# EAGLE design Modul_C_002x EAGLE 630 (EAGLE 6.3)
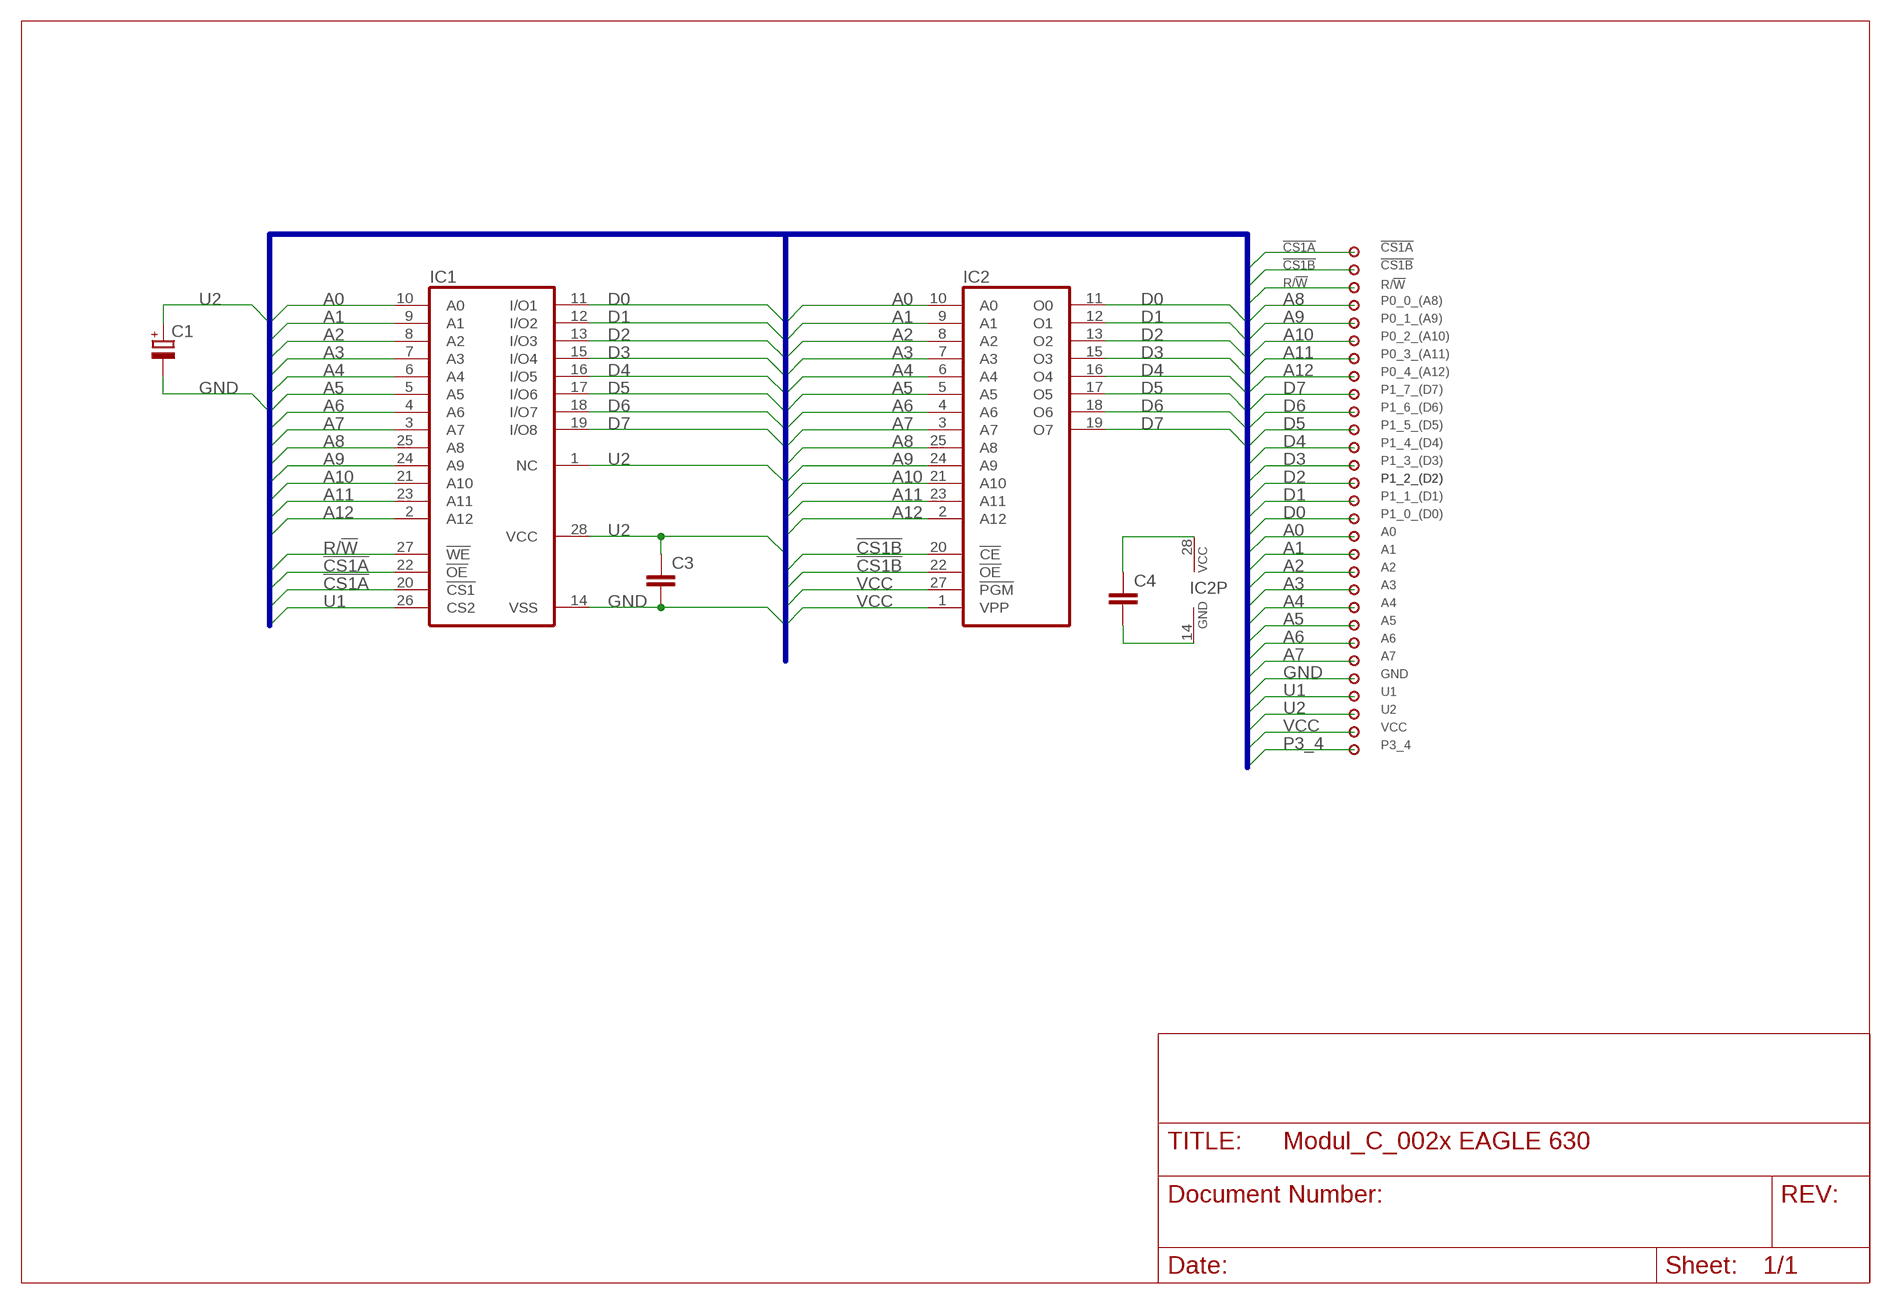
[diagram p0: schematic, sheet 1]

## Parts
C1  CPOL-EUE15-6AXIAL  [E15-6]
C3  C-EU025-024X044  [C025-024X044]
C4  C-EU025-024X044  [C025-024X044]
IC1  6264A  [DIL28-6]
IC2  2764  [DIL28]
U$1  BUS2929PUR  [BUS29_PUR]

## Nets
!CS1A: IC1.20(!CS1) IC1.22(!OE) U$1.1.29
!CS1B: IC2.20(!CE) IC2.22(!OE) U$1.1.28
A0: IC1.10(A0) IC2.10(A0) U$1.1.13
A1: IC1.9(A1) IC2.9(A1) U$1.1.12
A2: IC1.8(A2) IC2.8(A2) U$1.1.11
A3: IC1.7(A3) IC2.7(A3) U$1.1.10
A4: IC1.6(A4) IC2.6(A4) U$1.1.9
A5: IC1.5(A5) IC2.5(A5) U$1.1.8
A6: IC1.4(A6) IC2.4(A6) U$1.1.7
A7: IC1.3(A7) IC2.3(A7) U$1.1.6
A8: IC1.25(A8) IC2.25(A8) U$1.1.26
A9: IC1.24(A9) IC2.24(A9) U$1.1.25
A10: IC1.21(A10) IC2.21(A10) U$1.1.24
A11: IC1.23(A11) IC2.23(A11) U$1.1.23
A12: IC1.2(A12) IC2.2(A12) U$1.1.22
D0: IC1.11(I/O1) IC2.11(O0) U$1.1.14
D1: IC1.12(I/O2) IC2.12(O1) U$1.1.15
D2: IC1.13(I/O3) IC2.13(O2) U$1.1.16
D3: IC1.15(I/O4) IC2.15(O3) U$1.1.17
D4: IC1.16(I/O5) IC2.16(O4) U$1.1.18
D5: IC1.17(I/O6) IC2.17(O5) U$1.1.19
D6: IC1.18(I/O7) IC2.18(O6) U$1.1.20
D7: IC1.19(I/O8) IC2.19(O7) U$1.1.21
GND: C1.- C3.2 C4.2 IC1.14(VSS) IC2.14(GND) U$1.1.5
P3_4: U$1.1.1
R/!W: IC1.27(!WE) U$1.1.27
U1: IC1.26(CS2) U$1.1.4
U2: C1.+ C3.1 IC1.1(NC) IC1.28(VCC) U$1.1.3
VCC: C4.1 IC2.1(VPP) IC2.27(!PGM) IC2.28(VCC) U$1.1.2

## Buses
BUS1:A[0..12],D[0..7],GND,U1,U2,VCC,P3_4,R/!W,!CS1B,!CS1A

## Notes on the sheet
- !CS1A
- !CS1B
- GND
- U1
- U2
- VCC
- P3_4

## Library data of the parts
C1 = rcl:CPOL-EU: POLARIZED CAPACITOR, European symbol
C3 C4 = rcl:C-EU: CAPACITOR, European symbol
IC1 = memory-hitachi:6264A: MEMORY; OC_FARNELL: 283605; OC_NEWARK: unknown
IC2 = memory:2764: MEMORY
U$1 = NRF24L01_Radio:BUS29

## Board
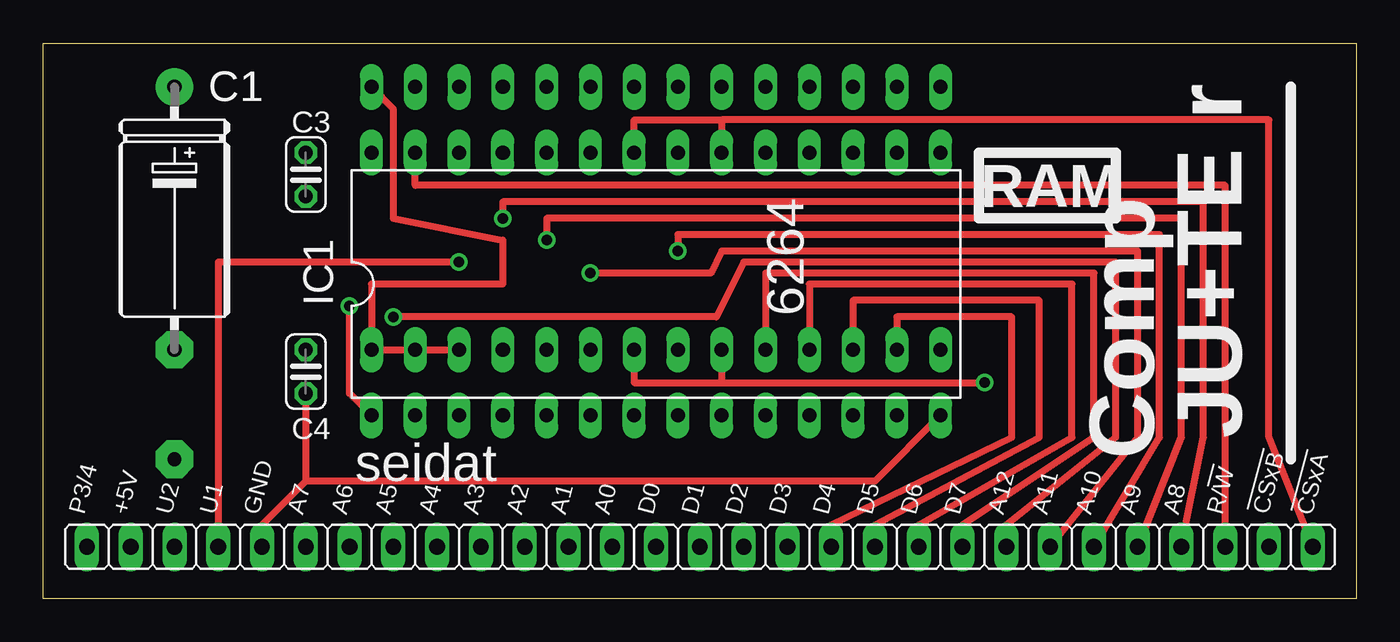
[diagram p1: board, top side]
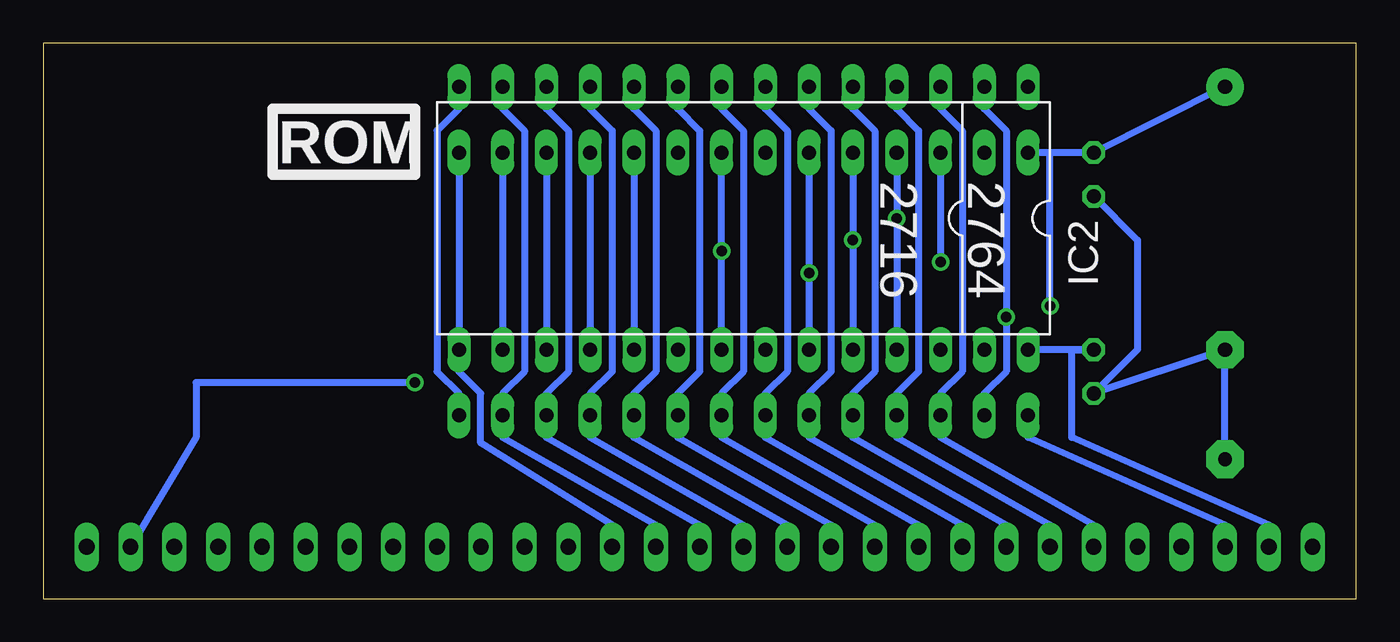
[diagram p2: board, bottom side, seen from below]

Size 76.19 x 32.22 mm. Coordinates in mm from the lower left corner, seen from the top.
Outline: 0,32.22 76.19,32.22 76.19,0 0,0 0,32.22
Copper layers (1*16): Top 0.035mm / dielectric 1.5mm / Bottom 0.035mm
Design rules "default": minimum track width 10mil, minimum drill 24mil, track to track 8mil, track to pad 8mil, pad to pad 8mil, via to via 8mil, smd to smd 8mil, copper to edge 40mil, drill to drill 8mil, minimum pad ring 10mil, minimum via ring 8mil, stop-mask expansion 4mil, vias tented up to drill 0mil, thermal gap 10mil

### Footprints (pad centres in the part's own frame; a part is rotated, then mirrored left to right if it is on the bottom)
E15-6 = drill 0.813 pad 2.159: + -7.62,0 | drill 0.813 pad 2.159 octagon: - 7.62,0
C025-024X044 = drill 0.813 octagon: 1 -1.27,0; 2 1.27,0
DIL28-6 = drill 0.813 long: 1 -16.51,-7.62; 2 -13.97,-7.62; 3 -11.43,-7.62; 4 -8.89,-7.62; 5 -6.35,-7.62; 6 -3.81,-7.62; 7 -1.27,-7.62; 8 1.27,-7.62; 9 3.81,-7.62; 10 6.35,-7.62; 11 8.89,-7.62; 12 11.43,-7.62; 13 13.97,-7.62; 14 16.51,-7.62; 15 16.51,7.62; 16 13.97,7.62; 17 11.43,7.62; 18 8.89,7.62; 19 6.35,7.62; 20 3.81,7.62; 21 1.27,7.62; 22 -1.27,7.62; 23 -3.81,7.62; 24 -6.35,7.62; 25 -8.89,7.62; 26 -11.43,7.62; 27 -13.97,7.62; 28 -16.51,7.62
DIL28 = drill 0.813 long: 1 -16.51,-7.62; 2 -13.97,-7.62; 3 -11.43,-7.62; 4 -8.89,-7.62; 5 -6.35,-7.62; 6 -3.81,-7.62; 7 -1.27,-7.62; 8 1.27,-7.62; 9 3.81,-7.62; 10 6.35,-7.62; 11 8.89,-7.62; 12 11.43,-7.62; 13 13.97,-7.62; 14 16.51,-7.62; 15 16.51,7.62; 16 13.97,7.62; 17 11.43,7.62; 18 8.89,7.62; 19 6.35,7.62; 20 3.81,7.62; 21 1.27,7.62; 22 -1.27,7.62; 23 -3.81,7.62; 24 -6.35,7.62; 25 -8.89,7.62; 26 -11.43,7.62; 27 -13.97,7.62; 28 -16.51,7.62
BUS29_PUR = drill 0.914 long: 1.1 0,0; 1.2 0,2.54; 1.3 0,5.08; 1.4 0,7.62; 1.5 0,10.16; 1.6 0,12.7; 1.7 0,15.24; 1.8 0,17.78; 1.9 0,20.32; 1.10 0,22.86; 1.11 0,25.4; 1.12 0,27.94; 1.13 0,30.48; 1.14 0,33.02; 1.15 0,35.56; 1.16 0,38.1; 1.17 0,40.64; 1.18 0,43.18; 1.19 0,45.72; 1.20 0,48.26; 1.21 0,50.8; 1.22 0,53.34; 1.23 0,55.88; 1.24 0,58.42; 1.25 0,60.96; 1.26 0,63.5; 1.27 0,66.04; 1.28 0,68.58; 1.29 0,71.12

### Placement (x,y rotation side)
C1  7.62,22.06 270 top
C3  15.24,24.6 270 top
C4  15.24,13.17 270 top
IC1  35.56,18.25 0 top
IC2  35.56,22.06 180 bottom
U$1  2.54,3.01 270 top

### Tracks (layer width: path | path; a pad name or v marks a point on that pad's centre or on a via)
!CS1A
  Top 0.406: U$1.1.29 71.12,9.36 71.12,27.77 39.37,27.77 | 39.37,27.77 IC1.20 | IC1.22 34.29,27.77 39.37,27.77
!CS1B  (via drill 0.61)
  Top 0.406: IC2.22 34.29,12.54 39.37,12.54 | 39.37,12.54 v54.61,12.54 | IC2.20 39.37,12.54
  Bottom 0.406: v54.61,12.54 67.31,12.54 67.31,9.36 U$1.1.28
A0
  Bottom 0.406: U$1.1.13 33.02,4.28 41.91,9.36 IC1.10 41.91,11.9 40.64,13.17 40.64,27.14 41.91,28.41 IC2.10
A1
  Bottom 0.406: U$1.1.12 30.48,4.28 39.37,9.36 IC1.9 39.37,11.9 38.1,13.17 38.1,27.14 39.37,28.41 IC2.9
A2
  Bottom 0.406: U$1.1.11 27.94,4.28 36.83,9.36 IC1.8 36.83,11.9 35.56,13.17 35.56,27.14 36.83,28.41 IC2.8
A3
  Bottom 0.406: U$1.1.10 25.4,4.28 34.29,9.36 IC1.7 34.29,11.9 33.02,13.17 33.02,27.14 34.29,28.41 IC2.7
A4
  Bottom 0.406: U$1.1.9 22.86,4.28 31.75,9.36 IC1.6 31.75,11.9 30.48,13.17 30.48,27.14 31.75,28.41 IC2.6
A5
  Bottom 0.406: U$1.1.8 20.32,4.28 29.21,9.36 IC1.5 29.21,11.9 27.94,13.17 27.94,27.14 29.21,28.41 IC2.5
A6
  Bottom 0.406: U$1.1.7 17.78,4.28 26.67,9.36 IC1.4 26.67,11.9 25.4,13.17 25.4,27.14 26.67,28.41 IC2.4
A7
  Bottom 0.406: U$1.1.6 15.24,4.28 24.13,9.36 IC1.3 24.13,11.9 22.86,13.17 22.86,27.14 24.13,28.41 IC2.3
A8  (via drill 0.61)
  Top 0.406: U$1.1.26 67.31,9.36 67.31,23.01 26.67,23.01 v26.67,22.06
  Bottom 0.406: IC1.25 v26.67,22.06 IC2.25
A9  (via drill 0.61)
  Top 0.406: U$1.1.25 66.04,9.36 66.04,22.06 29.21,22.06 v29.21,20.79
  Bottom 0.406: IC1.24 v29.21,20.79 IC2.24
A10  (via drill 0.61)
  Top 0.406: U$1.1.24 64.77,9.36 64.77,21.11 36.83,21.11 v36.83,20.15
  Bottom 0.406: IC2.21 v36.83,20.15 IC1.21
A11  (via drill 0.61)
  Top 0.406: U$1.1.23 63.5,9.36 63.5,20.15 39.37,20.15 38.73,18.88 v31.75,18.88
  Bottom 0.406: IC1.23 v31.75,18.88 IC2.23
A12  (via drill 0.61)
  Top 0.406: U$1.1.22 55.88,4.28 62.23,9.36 62.23,19.52 40.64,19.52 39.05,16.34 v20.32,16.34
  Bottom 0.406: IC2.2 21.59,28.41 20.32,27.14 v20.32,16.34 20.32,13.17 21.59,11.9 IC1.2
D0
  Bottom 0.406: U$1.1.14 35.56,4.28 44.45,9.36 IC1.11 44.45,11.9 43.18,13.17 43.18,27.14 44.45,28.41 IC2.11
D1
  Bottom 0.406: U$1.1.15 38.1,4.28 46.99,9.36 IC1.12 46.99,11.9 45.72,13.17 45.72,27.14 46.99,28.41 IC2.12
D2
  Bottom 0.406: U$1.1.16 40.64,4.28 49.53,9.36 IC1.13 49.53,11.9 48.26,13.17 48.26,27.14 49.53,28.41 IC2.13
D3
  Bottom 0.406: IC1.15 IC2.15 52.07,13.17 50.8,11.9 50.8,9.04 43.18,4.28 U$1.1.17
D4
  Top 0.406: U$1.1.18 45.72,4.28 56.2,9.36 56.2,16.34 49.53,16.34 IC2.16
  Bottom 0.406: IC1.16 IC2.16
D5
  Top 0.406: U$1.1.19 48.26,4.28 57.78,9.36 57.78,17.3 46.99,17.3 IC2.17
  Bottom 0.406: IC1.17 IC2.17
D6
  Top 0.406: U$1.1.20 50.8,4.28 59.69,9.36 59.69,18.25 44.45,18.25 IC2.18
  Bottom 0.406: IC1.18 IC2.18
D7
  Top 0.406: U$1.1.21 53.34,4.28 60.96,9.36 60.96,18.88 41.91,18.88 IC2.19
  Bottom 0.406: IC1.19 IC2.19
GND  (via drill 0.8 pad 2.18)
  Top 0.406: IC1.14 48.26,6.82 15.24,6.82 | 15.24,6.82 12.7,4.28 U$1.1.5 | C4.2 15.24,6.82
  Bottom 0.406: IC2.14 52.07,28.41 53.34,27.14 53.34,13.17 52.07,11.9 IC1.14 | C3.2 12.7,20.79 12.7,14.44 C4.2 C1.- v7.62,8.09
N$1
  Top 0.406: 21.59,14.44 24.13,14.44
R/!W
  Top 0.406: U$1.1.27 68.58,23.96 21.59,23.96 IC1.27
U1  (via drill 0.61)
  Top 0.406: v24.13,19.52 10.16,19.52 U$1.1.4
  Bottom 0.406: IC1.26 v24.13,19.52
U2  (via drill 0.61)
  Top 0.406: IC1.1 17.78,11.9 v17.78,16.98
  Bottom 0.406: 17.78,25.87 C3.1 C1.+ | 17.78,25.87 IC1.28 | U$1.1.3 7.62,4.28 19.05,9.36 IC1.1 | v17.78,16.98 17.78,25.87
VCC
  Top 0.406: IC2.1 20.32,28.41 20.32,22.06 26.67,20.79 26.67,18.25 19.05,18.25 IC2.28 IC2.27
  Bottom 0.406: U$1.1.2 5.08,4.28 16.51,9.36 16.51,14.44 C4.1 IC2.28

### Text on the board
tPlace: r | RAM | 6264 | JU+TE | Comp | P3/4 | +5V | U2 | U1 | GND | A7 | A6 | A5 | A4 | A3 | A2 | A1 | A0 | D0 | D1 | D2 | D3 | D4 | D5 | D6 | D7 | A12 | A11 | A10 | A9 | A8 | R/!W | !CSxB | !CSxA
bPlace: ROM | 2764 | 2716
tNames: seidat